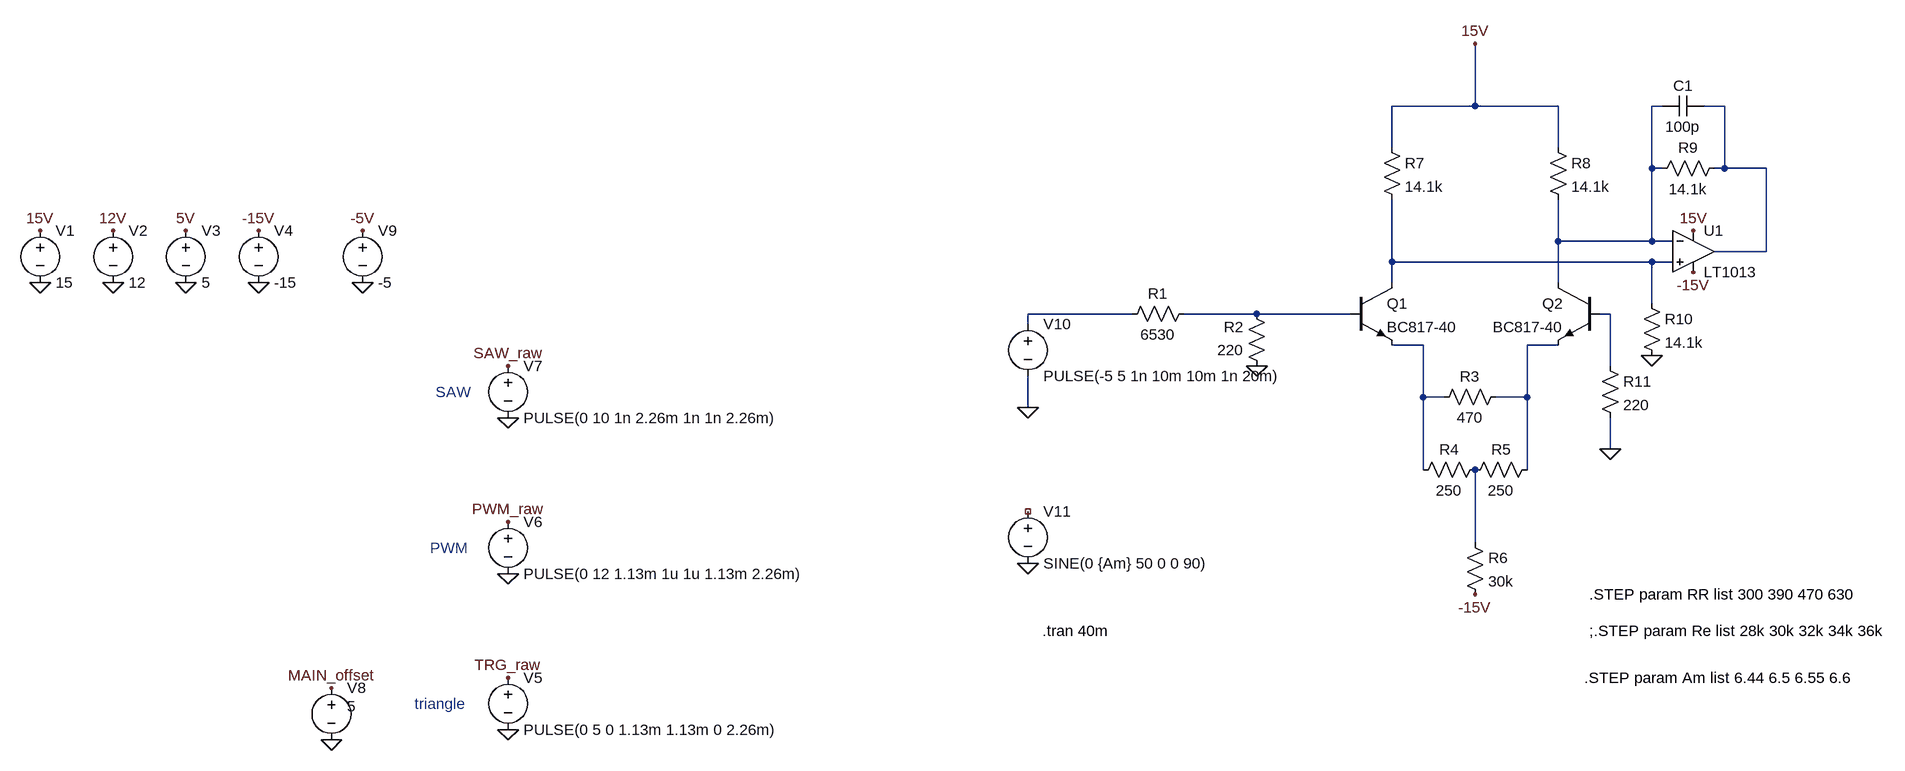
[diagram p0: schematic Trialngle2sine.asc]
Trialngle2sine.asc, the LTspice schematic file:
Version 4
SHEET 1 2828 824
WIRE 2112 -176 2112 -272
WIRE 2112 -176 1984 -176
WIRE 2240 -176 2112 -176
WIRE 2400 -176 2384 -176
WIRE 2496 -176 2464 -176
WIRE 1984 -112 1984 -176
WIRE 2240 -112 2240 -176
WIRE 2384 -80 2384 -176
WIRE 2400 -80 2384 -80
WIRE 2496 -80 2496 -176
WIRE 2496 -80 2480 -80
WIRE 2560 -80 2496 -80
WIRE 2240 32 2240 -32
WIRE 2384 32 2384 -80
WIRE 2384 32 2240 32
WIRE 2416 32 2384 32
WIRE 2560 48 2560 -80
WIRE 2560 48 2480 48
WIRE 1984 64 1984 -32
WIRE 2384 64 1984 64
WIRE 2416 64 2384 64
WIRE 1984 96 1984 64
WIRE 2240 96 2240 32
WIRE 2384 128 2384 64
WIRE 1584 144 1424 144
WIRE 1776 144 1664 144
WIRE 1920 144 1776 144
WIRE 2320 144 2304 144
WIRE 1424 160 1424 144
WIRE 2032 192 1984 192
WIRE 2240 192 2192 192
WIRE 2320 224 2320 144
WIRE 2032 272 2032 192
WIRE 2064 272 2032 272
WIRE 2192 272 2192 192
WIRE 2192 272 2144 272
WIRE 1424 288 1424 240
WIRE 2320 352 2320 304
WIRE 2032 384 2032 272
WIRE 2192 384 2192 272
WIRE 2112 496 2112 384
FLAG -96 96 0
FLAG 16 96 0
FLAG 128 96 0
FLAG 240 96 0
FLAG -96 16 15V
FLAG 16 16 12V
FLAG 128 16 5V
FLAG 240 16 -15V
FLAG 624 784 0
FLAG 624 544 0
FLAG 624 304 0
FLAG 624 224 SAW_raw
FLAG 624 464 PWM_raw
FLAG 624 704 TRG_raw
FLAG 352 800 0
FLAG 352 720 MAIN_offset
FLAG 400 96 0
FLAG 400 16 -5V
FLAG 2112 576 -15V
FLAG 1776 224 0
FLAG 2112 -272 15V
FLAG 2384 208 0
FLAG 2320 352 0
FLAG 1424 288 0
FLAG 2448 16 15V
FLAG 2448 80 -15V
FLAG 1424 528 0
SYMBOL voltage -96 0 R0
WINDOW 123 0 0 Left 0
WINDOW 39 0 0 Left 0
SYMATTR InstName V1
SYMATTR Value 15
SYMBOL voltage 16 0 R0
WINDOW 123 0 0 Left 0
WINDOW 39 0 0 Left 0
SYMATTR InstName V2
SYMATTR Value 12
SYMBOL voltage 128 0 R0
WINDOW 123 0 0 Left 0
WINDOW 39 0 0 Left 0
SYMATTR InstName V3
SYMATTR Value 5
SYMBOL voltage 240 0 R0
WINDOW 123 0 0 Left 0
WINDOW 39 0 0 Left 0
SYMATTR InstName V4
SYMATTR Value -15
SYMBOL voltage 624 688 R0
WINDOW 123 0 0 Left 0
WINDOW 39 0 0 Left 0
SYMATTR InstName V5
SYMATTR Value PULSE(0 5 0 1.13m 1.13m 0 2.26m)
SYMBOL voltage 624 448 R0
WINDOW 123 0 0 Left 0
WINDOW 39 0 0 Left 0
SYMATTR InstName V6
SYMATTR Value PULSE(0 12 1.13m 1u 1u 1.13m 2.26m)
SYMBOL voltage 624 208 R0
WINDOW 123 0 0 Left 0
WINDOW 39 0 0 Left 0
SYMATTR InstName V7
SYMATTR Value PULSE(0 10 1n 2.26m 1n 1n 2.26m)
SYMBOL voltage 352 704 R0
WINDOW 3 24 44 Left 2
WINDOW 123 0 0 Left 0
WINDOW 39 0 0 Left 0
SYMATTR InstName V8
SYMATTR Value 5
SYMBOL voltage 400 0 R0
WINDOW 123 0 0 Left 0
WINDOW 39 0 0 Left 0
SYMATTR InstName V9
SYMATTR Value -5
SYMBOL res 1680 128 R90
WINDOW 0 0 56 VBottom 2
WINDOW 3 32 56 VTop 2
SYMATTR InstName R1
SYMATTR Value 6530
SYMBOL res 1792 240 R180
WINDOW 0 36 76 Left 2
WINDOW 3 36 40 Left 2
SYMATTR InstName R2
SYMATTR Value 220
SYMBOL npn 1920 96 R0
SYMATTR InstName Q1
SYMATTR Value BC817-40
SYMBOL npn 2304 96 M0
SYMATTR InstName Q2
SYMATTR Value BC817-40
SYMBOL res 2160 256 R90
WINDOW 0 0 56 VBottom 2
WINDOW 3 32 56 VTop 2
SYMATTR InstName R3
SYMATTR Value 470
SYMBOL res 2128 368 R90
WINDOW 0 0 56 VBottom 2
WINDOW 3 32 56 VTop 2
SYMATTR InstName R4
SYMATTR Value 250
SYMBOL res 2096 400 R270
WINDOW 0 32 56 VTop 2
WINDOW 3 0 56 VBottom 2
SYMATTR InstName R5
SYMATTR Value 250
SYMBOL res 2096 480 R0
SYMATTR InstName R6
SYMATTR Value 30k
SYMBOL res 1968 -128 R0
SYMATTR InstName R7
SYMATTR Value 14.1k
SYMBOL res 2224 -128 R0
SYMATTR InstName R8
SYMATTR Value 14.1k
SYMBOL res 2496 -96 R90
WINDOW 0 0 56 VBottom 2
WINDOW 3 32 56 VTop 2
SYMATTR InstName R9
SYMATTR Value 14.1k
SYMBOL cap 2464 -192 R90
WINDOW 0 0 32 VBottom 2
WINDOW 3 32 32 VTop 2
SYMATTR InstName C1
SYMATTR Value 100p
SYMBOL res 2368 112 R0
SYMATTR InstName R10
SYMATTR Value 14.1k
SYMBOL res 2304 208 R0
SYMATTR InstName R11
SYMATTR Value 220
SYMBOL voltage 1424 144 R0
WINDOW 123 0 0 Left 0
WINDOW 39 0 0 Left 0
SYMATTR InstName V10
SYMATTR Value PULSE(-5 5 1n 10m 10m 1n 20m)
SYMBOL voltage 1424 432 R0
WINDOW 123 0 0 Left 0
WINDOW 39 0 0 Left 0
SYMATTR InstName V11
SYMATTR Value SINE(0 {Am} 50 0 0 90)
SYMBOL OpAmps\\LT1013 2448 -16 R0
SYMATTR InstName U1
TEXT 1446 632 Left 2 !.tran 40m
TEXT 512 264 Left 2 ;SAW
TEXT 504 504 Left 2 ;PWM
TEXT 480 744 Left 2 ;triangle
TEXT 2288 576 Left 2 !.STEP param RR list 300 390 470 630
TEXT 2288 632 Left 2 !;.STEP param Re list 28k 30k 32k 34k 36k
TEXT 2280 704 Left 2 !.STEP param Am list 6.44 6.5 6.55 6.6

The netlist it stands for:
* Trialngle2sine.asc
V1 15V 0 15
V2 12V 0 12
V3 5V 0 5
V4 -15V 0 -15
V5 TRG_raw 0 PULSE(0 5 0 1.13m 1.13m 0 2.26m)
V6 PWM_raw 0 PULSE(0 12 1.13m 1u 1u 1.13m 2.26m)
V7 SAW_raw 0 PULSE(0 10 1n 2.26m 1n 1n 2.26m)
V8 MAIN_offset 0 5
V9 -5V 0 -5
R1 N005 N004 6530
R2 0 N005 220
Q1 N003 N005 N007 0 BC817-40
Q2 N001 N006 N008 0 BC817-40
R3 N008 N007 470
R4 N009 N007 250
R5 N009 N008 250
R6 N009 -15V 30k
R7 15V N003 14.1k
R8 15V N001 14.1k
R9 N002 N001 14.1k
C1 N002 N001 100p
R10 N003 0 14.1k
R11 N006 0 220
V10 N004 0 PULSE(-5 5 1n 10m 10m 1n 20m)
V11 NC_01 0 SINE(0 {Am} 50 0 0 90)
XU1 N003 N001 15V -15V N002 LT1013  ; pins In+ In- V+ V- OUT
.model NPN NPN
.model PNP PNP
.lib standard.bjt
.tran 40m
* SAW
* PWM
* triangle
.STEP param RR list 300 390 470 630
;.STEP param Re list 28k 30k 32k 34k 36k
.STEP param Am list 6.44 6.5 6.55 6.6
.lib LTC.lib
.backanno
.end